# Altium schematic sheet Battery_Charger.SchDoc
size A3; SheetNumber: 3; SheetTotal: 4
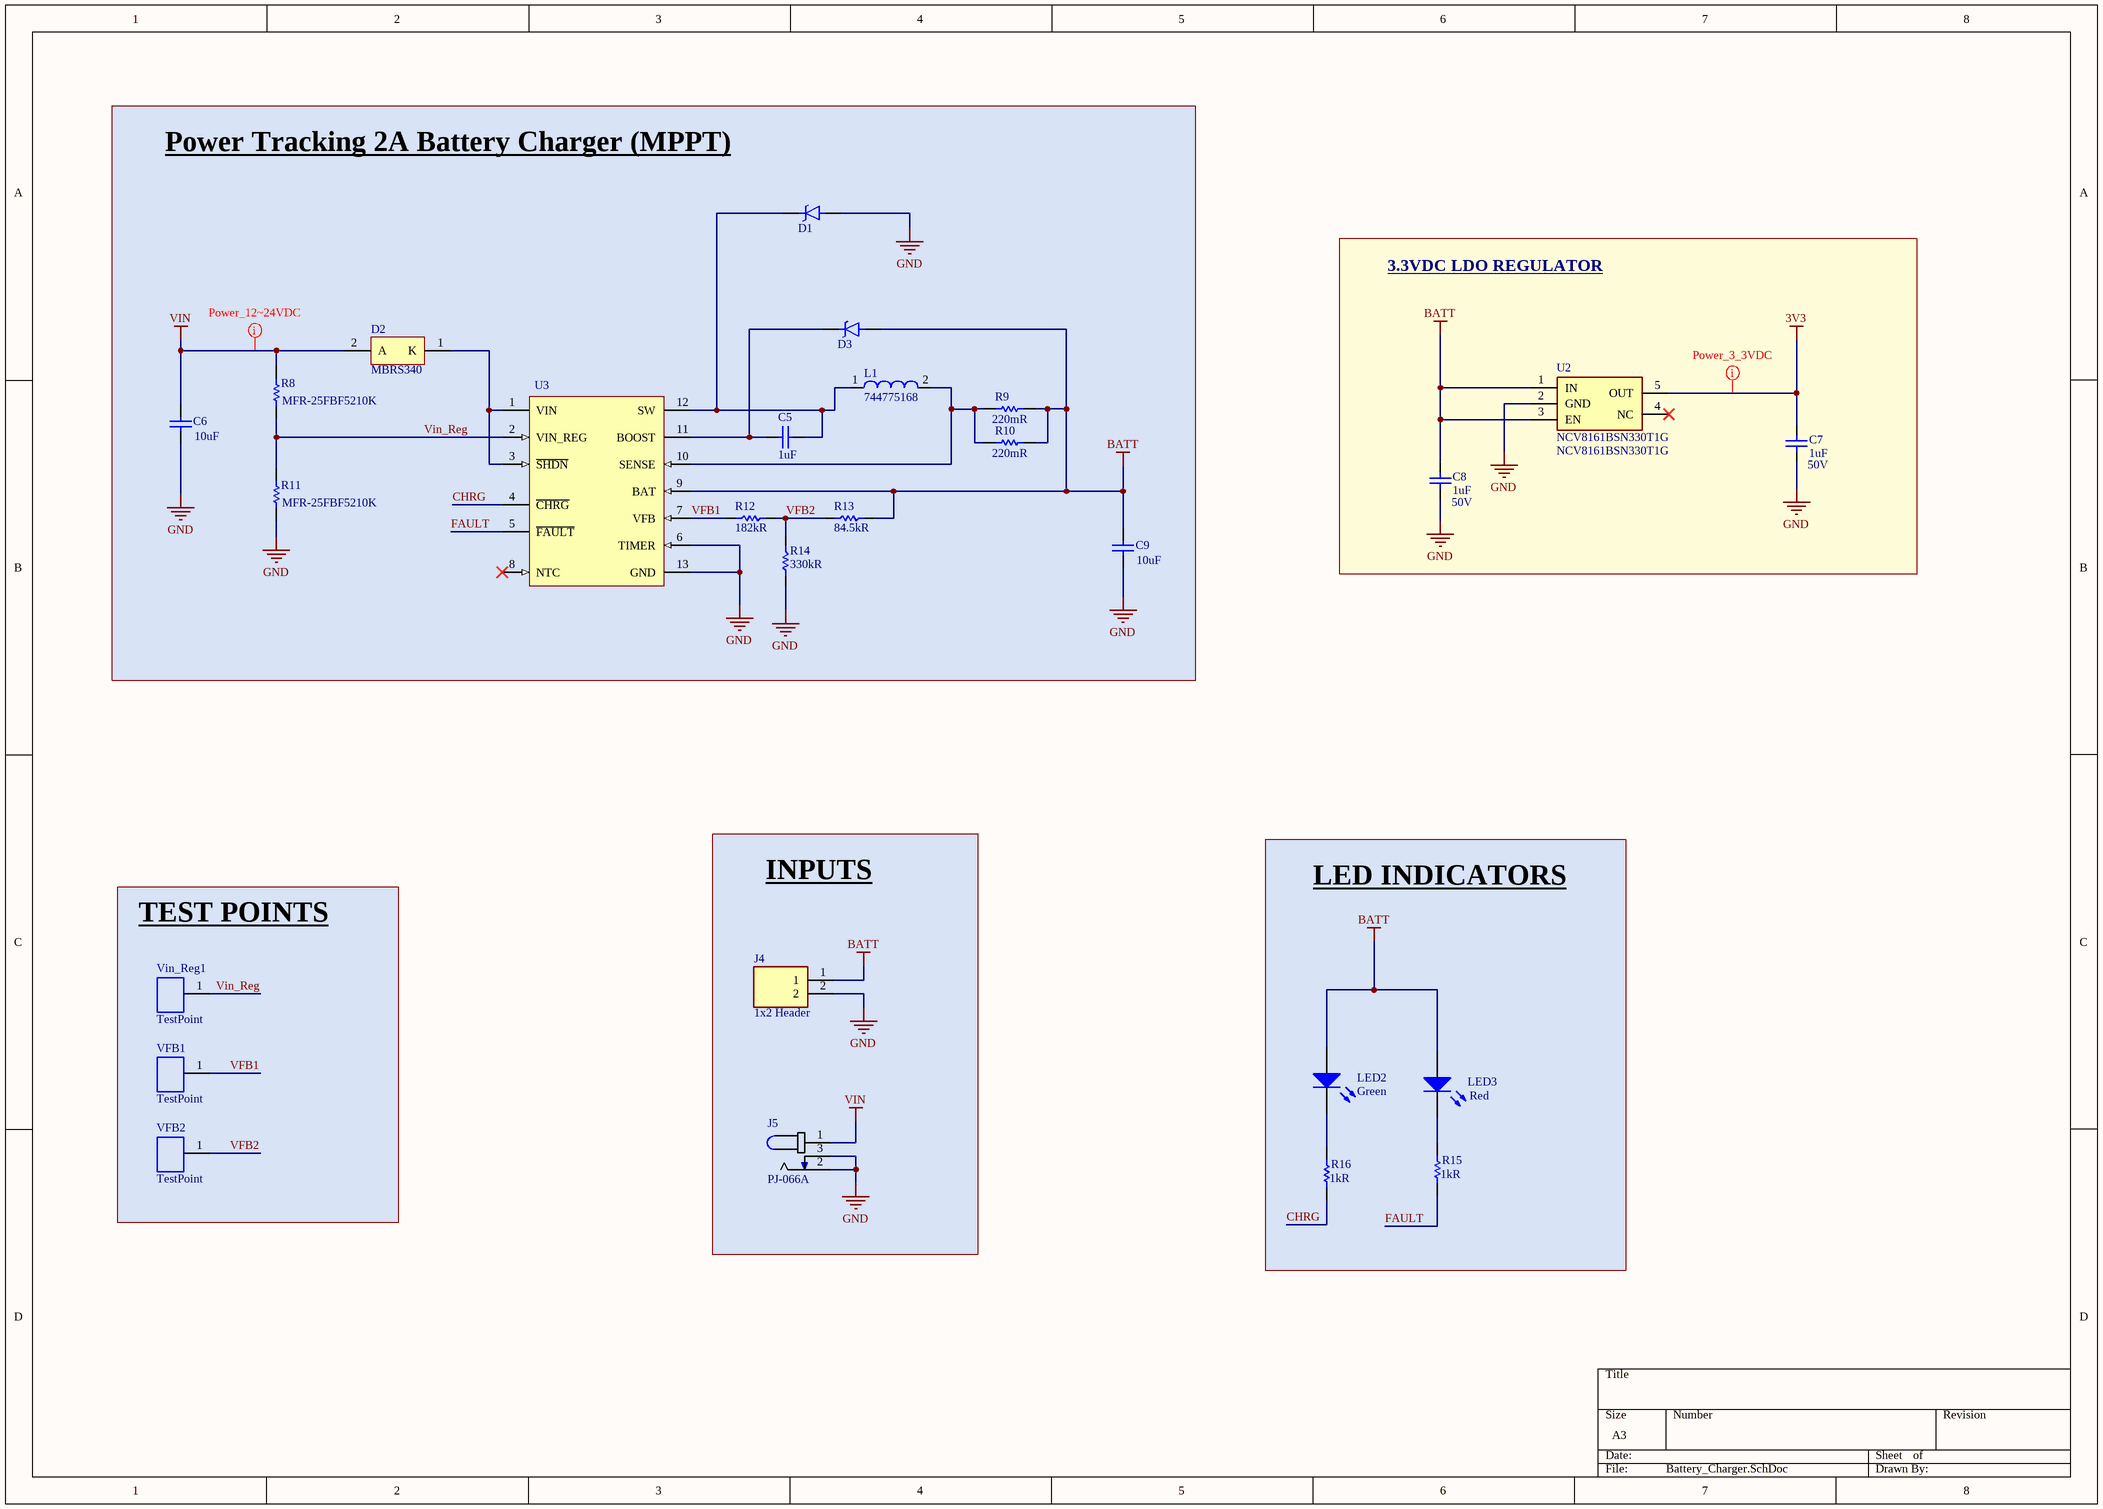
[diagram p0: Battery_Charger.SchDoc]

## Parts
C5  Capacitance: 1uF  [CAPC0805(2012)100_M]  (hidden comment: https://www.digikey.com/product-detail/en/w-rth-elektronik/885012107015/732-7625-1-ND/5454252)
C6  Capacitance: 10uF  [CAPC1206(3216)190_M]  (hidden comment: https://www.digikey.com/product-detail/en/samsung-electro-mechanics/CL31A106MBHNNNE/1276-6736-1-ND/5961595)
C7  1uF  Voltage Rating: 50V  [Cap 0805 (2012 Metric)]
C8  1uF  Voltage Rating: 50V  [Cap 0805 (2012 Metric)]
C9  Capacitance: 10uF  [CAPC1206(3216)190_M]  (hidden comment: https://www.digikey.com/product-detail/en/samsung-electro-mechanics/CL31A106MBHNNNE/1276-6736-1-ND/5961595)
D1  https://www.digikey.com/product-detail/en/diodes-incorporated/ZLLS500TA/ZLLS500CT-ND/560650  [SOT-23]  (value not drawn)
D2  Manufacturer Part Number: MBRS340  [ONSC-SMC-2-403-03_V]  (hidden comment: https://www.digikey.com/product-detail/en/on-semiconductor/MBRS340/MBRS340FSCT-ND/965655)
D3  https://www.digikey.com/product-detail/en/diodes-incorporated/ZLLS500TA/ZLLS500CT-ND/560650  [SOT-23]  (value not drawn)
J4  1x2 Header  [S2B-PH-K-S(LF)(SN)]
J5  https://www.digikey.com/product-detail/en/cui-devices/PJ-066A/CP-066A-ND/2627225  [PJ-066A]  (value not drawn)
L1  744775168  [WE-PD2-L]
LED2  Illumination Color: Green  [0805_A]  (hidden comment: https://www.digikey.com/product-detail/en/osram-opto-semiconductors-inc/LG-R971-KN-1/475-1410-1-ND/1802598)
LED3  Color: Red  [0805_A]  (hidden comment: https://www.digikey.com/product-detail/en/wurth-electronics-inc/150080RS75000/732-4984-1-ND/4489916)
R8  MFR-25FBF5210K  [RESA60-630X240]
R9  Resistance: 220mR  [RESC0805(2012)_N]  (hidden comment: https://www.digikey.com/product-detail/en/panasonic-electronic-components/ERJ-6RQFR22V/P.22DCT-ND/250302)
R10  Resistance: 220mR  [RESC0805(2012)_N]  (hidden comment: https://www.digikey.com/product-detail/en/panasonic-electronic-components/ERJ-6RQFR22V/P.22DCT-ND/250302)
R11  MFR-25FBF5210K  [RESA60-630X240]
R12  182kR  [Res 0805 (2012 Metric)]
R13  84.5kR  [Res 0805 (2012 Metric)]
R14  330kR  [Res 0805 (2012 Metric)]
R15  Resistance: 1kR  [RESC0805(2012)_M]  (hidden comment: https://www.digikey.com/product-detail/en/stackpole-electronics-inc/RNCP0805FTD1K00/RNCP0805FTD1K00CT-ND/2240568)
R16  Resistance: 1kR  [RESC0805(2012)_M]  (hidden comment: https://www.digikey.com/product-detail/en/stackpole-electronics-inc/RNCP0805FTD1K00/RNCP0805FTD1K00CT-ND/2240568)
U2  NCV8161BSN330T1G  [NCV8161BSN330T1G]
U3  https://www.digikey.com/product-detail/en/linear-technology-analog-devices/LT3652HVEMSE-TRPBF/LT3652HVEMSE-TRPBFCT-ND/8040618  [12-Lead Plastic MSOP]  (value not drawn)
VFB1  TestPoint  [TestPoint]
VFB2  TestPoint  [TestPoint]
Vin_Reg1  TestPoint  [TestPoint]

## Blocks framed on the sheet
Power Tracking 2A Battery Charger (MPPT): C5 C6 C9 D1-D3 L1 R8-R14 U3
3.3VDC LDO REGULATOR: C7 C8 U2
INPUTS: J4 J5
LED INDICATORS: LED2 LED3 R15 R16
TEST POINTS: VFB1 VFB2 Vin_Reg1

## Nets
3V3: C7.1 U2.5(OUT)
BATT: C8.1 C9.2 D3.1(A) J4.1 LED2.2(A) LED3.2(A) R9.2 R10.2 R13.2 U2.1(IN) U2.3(EN) U3.9(BAT)
GND: C6.1 C7.2 C8.2 C9.1 D1.1(A) J4.2 J5.2 J5.3 R11.2 R14.2 U2.2(GND) U3.6(TIMER) U3.13(GND)
VIN: C6.2 D2.2(A) J5.1 R8.1
CHRG: R16.2 U3.4(~{CHRG})
FAULT: R15.2 U3.5(~{FAULT})
VFB1: R12.1 U3.7(VFB) VFB1.1
VFB2: R12.2 R13.1 R14.1 VFB2.1
Vin_Reg: R8.2 R11.1 U3.2(VIN_REG) Vin_Reg1.1
NetC5_1: C5.1 D3.3(C) U3.11(BOOST)
NetC5_2: C5.2 D1.3(C) L1.1 U3.12(SW)
NetD2_1: D2.1(K) U3.1(VIN) U3.3(~{SHDN})
NetL1_2: L1.2 R9.1 R10.1 U3.10(SENSE)
NetLED2_1: LED2.1(K) R16.1
NetLED3_1: LED3.1(K) R15.1

Not connected (* = marked no-connect by the designer): U2 4(NC)*; U3 8(NTC)*

## Layout directives
net class Power_3_3VDC: 3V3
net class Power_12~24VDC: VIN

## Library data of the parts
C5 = CMP-1036-04758-1: CAP CER 1UF 25V X5R 0805; Manufacturer: Wurth Electronics; Tolerance: 20%; Supplier 1: Digi-Key; Supplier Part Number 1: 732-7625-1-ND; Manufacturer Part Number: 885012107015; Stock 1: 1863; Pricing 1: 1=0,10000, 10=0,07900, 100=0,07080, 500=0,06266 (USD); RoHS: Yes; Mount: Surface Mount; Case/Package: 0805; Case Code (Metric): 2012; Case Code (Imperial): 0805; Min Operating Temperature: -55°C; Max Operating Temperature: 85°C; Packaging: Tape and Reel; Voltage Rating: 25V; Length: 0.079inch; Width: 0.049inch; Thickness: 0.053inch; ComponentLink1URL: http://www.farnell.com/datasheets/2031769.pdf?src-supplier=Farnell; ComponentLink1Description: http://www.farnell.com/datasheets/2031769.pdf?src-supplier=Farnell; ComponentLink2URL: https://katalog.we-online.de/pbs/datasheet/885012107015.pdf?src-supplier=Digi-Key; ComponentLink2Description: https://katalog.we-online.de/pbs/datasheet/885012107015.pdf?src-supplier=Digi-Key; ComponentLink3URL: http://katalog.we-online.de/pbs/datasheet/885012107015.pdf?src-supplier=Digi-Key; ComponentLink3Description: http://katalog.we-online.de/pbs/datasheet/885012107015.pdf?src-supplier=Digi-Key; Link: https://www.digikey.com/es/products/detail/w%C3%BCrth-elektronik/885012107015/5453480?s=N4IgTCBcDaIBxwKwAYCMZXIOxsSAugL5A
C6 C9 = CMP-1037-04982-1: CAP CER 10UF 50V X5R 1206; Tolerance: 20%; Supplier 1: Digi-Key; Supplier Part Number 1: 1276-6736-1-ND; Manufacturer: Samsung; Manufacturer Part Number: CL31A106MBHNNNE; Stock 1: 630197; Pricing 1: 1=0,30000, 10=0,20800, 100=0,11800, 500=0,08328, 1000=0,07287 (USD); RoHS: Yes; Mount: Surface Mount; Case/Package: 1206; Case Code (Metric): 3216; Case Code (Imperial): 1206; Min Operating Temperature: -55°C; Max Operating Temperature: 85°C; Packaging: Tape and Reel; Voltage Rating: 50V; Dielectric: X5R; Voltage Rating (DC): 50V; Length: 0.126inch; Width: 0.063inch; Thickness: 0.071inch; ComponentLink1URL: http://www.samsungsem.com/kr/support/product-search/mlcc/CL31A106MBHNNNE.jsp?src-supplier=Digi-Key; ComponentLink1Description: http://www.samsungsem.com/kr/support/product-search/mlcc/CL31A106MBHNNNE.jsp?src-supplier=Digi-Key
  C6: Link: https://www.digikey.com/en/products/detail/samsung-electro-mechanics/CL31A106MBHNNNE/5961220?s=N4IgTCBcDaIMIBkDMBGAgigDANgLICEAJAOVIFEQBdAXyA
  C9: ComponentLink2Description: New link; ComponentLink2URL: *; Link: https://www.digikey.com/es/products/detail/samsung-electro-mechanics/CL31A106MBHNNNE/5961220?s=N4IgTCBcDaIMIBkDMBGAgigDANgLICEAJAOVIFEQBdAXyA
C7 C8 = Capacitor: Cap Ceramic 1uF 50V Y5V -20% to 80% SMD 0805 85C T/R; Manufacturer: Samsung; Manufacturer Part Number: CL21F105ZBFNNNG; Link: https://www.digikey.com/en/products/detail/samsung-electro-mechanics/CL21F105ZBFNNNG/3894627; Supplier 1: Digi-Key; Supplier Part Number 1: 1276-6495-1-ND; RoHS: Yes; Category: Ceramic Capacitors; Stock 1: 53286; Pricing 1: 1=0,14000, 10=0,10300, 50=0,05840, 100=0,04840, 500=0,03396, 1000=0,02811 (USD); Mount: Surface Mount; Case/Package: 0805; Case Code (Metric): 2012; Case Code (Imperial): 0805; Material: Ceramic; Min Operating Temperature: -30°C; Max Operating Temperature: 85°C; Tolerance: 80%; Packaging: Tape and Reel; Capacitance: 1uF; Package Quantity: 3000; Dielectric: Y5V; Length: 2mm; Width: 0.049inch; Thickness: 0.053inch; Depth: 1.25mm; Radiation Hardening: No; Lead Free: Lead Free; RoHS Compliant: Yes; ComponentLink1URL: https://datasheet.ciiva.com/25734/cl21f105zbfnnng-25734639.pdf?src-supplier=Digi-Key; ComponentLink1Description: https://datasheet.ciiva.com/25734/cl21f105zbfnnng-25734639.pdf?src-supplier=Digi-Key; ComponentLink2URL: https://datasheet.ciiva.com/26838/getdatasheetpartid-650871-26838829.pdf?src-supplier=Verical; ComponentLink2Description: https://datasheet.ciiva.com/26838/getdatasheetpartid-650871-26838829.pdf?src-supplier=Verical; ComponentLink3URL: https://datasheet.ciiva.com/29199/455947-da-01-en-vs-kondensator-0805-29199048.pdf?src-supplier=Conrad; ComponentLink3Description: https://datasheet.ciiva.com/29199/455947-da-01-en-vs-kondensator-0805-29199048.pdf?src-supplier=Conrad; ComponentLink4URL: https://datasheet.ciiva.com/26310/mlcc-catalogdownload2013-eng-26310157.pdf?src-supplier=Distrelec; ComponentLink4Description: https://datasheet.ciiva.com/26310/mlcc-catalogdownload2013-eng-26310157.pdf?src-supplier=Distrelec; ComponentLink5URL: https://datasheet.ciiva.com/16437/cl05b104kq5nnnc-16437223.pdf?src-supplier=Future+Electronics; ComponentLink5Description: https://datasheet.ciiva.com/16437/cl05b104kq5nnnc-16437223.pdf?src-supplier=Future+Electronics
D1 D3 = ZLLS500TA: DIODE SCHOTTKY 40V 700MA SOT23-3; Manufacturer: Diodes Zetex; Peak Non-Repetitive Surge Current: 13A; Element Configuration: Single; Forward Voltage: 800mV; Peak Reverse Current: 10uA; Reverse Recovery Time: 3ns; Max Forward Surge Current (Ifsm): 3.2A; Power Dissipation: 500mW; Polarity: Standard; Capacitance: 16pF; Supplier 1: Digi-Key; Stock 1: 48400; Pricing 1: 1=0,50000, 10=0,42900, 100=0,32030, 500=0,25168, 1000=0,19448 (USD); RoHS: Yes; Mount: Surface Mount; Case/Package: SOT-23; Number of Pins: 3; Weight: 0.000282oz; Min Operating Temperature: -55°C; Max Operating Temperature: 150°C; Forward Current: 700mA; Max Repetitive Reverse Voltage (Vrrm): 40V; Package Quantity: 3000; Packaging: Tape and Reel; Average Rectified Current: 700mA; Termination: SMD/SMT; Voltage Rating (DC): 40V; Current Rating: 700mA; Output Current: 700mA; Max Reverse Voltage (DC): 40V; Length: 3.05mm; Height: 1mm; Width: 1.4mm; Radiation Hardening: No; Lead Free: Lead Free; ComponentLink1URL: https://datasheet.ciiva.com/914/zlls500-914480.pdf?src-supplier=Digi-Key; ComponentLink1Description: https://datasheet.ciiva.com/914/zlls500-914480.pdf?src-supplier=Digi-Key; ComponentLink2URL: https://datasheet.ciiva.com/4715/zlls500-4715543.pdf?src-supplier=Mouser; ComponentLink2Description: https://datasheet.ciiva.com/4715/zlls500-4715543.pdf?src-supplier=Mouser; ComponentLink3URL: https://datasheet.ciiva.com/8301/zlls500-8301566.pdf?src-supplier=Avnet; ComponentLink3Description: https://datasheet.ciiva.com/8301/zlls500-8301566.pdf?src-supplier=Avnet; Supplier Part Number 1: ZLLS500CT-ND; Manufacturer Part Number: ZLLS500TA; Link: https://www.digikey.com/es/products/detail/diodes-incorporated/ZLLS500TA/560622
D2 = CMP-1055-00395-1: DIODE SCHOTTKY 40V 4A SMC; Manufacturer: ON Semiconductor / Fairchild; Element Configuration: Single; Forward Voltage: 525mV; Max Surge Current: 80A; Current Rating: 3A; Peak Reverse Current: 2mA; Polarity: Standard; ComponentLink2URL: http://www.onsemi.cn/pub_link/Collateral/MBRS340T3-D.PDF; ComponentLink2Description: Datasheet; ComponentLink1URL: http://www.onsemi.com/; ComponentLink1Description: Manufacturer URL; ComponentLink3Description: Package Specification; ComponentLink3URL: http://www.onsemi.com/pub_link/Collateral/403-03.PDF; Supplier 1: Digi-Key; Supplier Part Number 1: MBRS340FSCT-ND; Stock 1: 6086; Pricing 1: 1=0,47000, 10=0,37700, 100=0,25680, 500=0,19258, 1000=0,14443 (USD); RoHS: Yes; Mount: Surface Mount; Case/Package: SMC; Number of Pins: 2; Weight: 0.3g; Contact Plating: Tin,Matte; Min Operating Temperature: -65°C; Max Operating Temperature: 125°C; Packaging: Tape and Reel; Average Rectified Current: 4A; Max Reverse Voltage (DC): 40V; Package Quantity: 1; Max Repetitive Reverse Voltage (Vrrm): 40V; Forward Current: 4A; Max Reverse Leakage Current: 2mA; Peak Non-Repetitive Surge Current: 80A; Max Forward Surge Current (Ifsm): 80A; Voltage Rating (DC): 40V; Output Current: 3A; Length: 7.15mm; Height: 2.75mm; Width: 6.25mm; Radiation Hardening: No; Lead Free: Lead Free; REACH SVHC: No SVHC; ComponentLink4URL: https://datasheet.ciiva.com/22651/48013-22651968.pdf?src-supplier=Element14; ComponentLink4Description: https://datasheet.ciiva.com/22651/48013-22651968.pdf?src-supplier=Element14; ComponentLink5URL: https://datasheet.ciiva.com/4714/mbrs340-63506-4714275.pdf?src-supplier=Mouser; ComponentLink5Description: https://datasheet.ciiva.com/4714/mbrs340-63506-4714275.pdf?src-supplier=Mouser; ComponentLink6URL: https://datasheet.ciiva.com/30479/0900766b810e2514-30479354.pdf?src-supplier=RSComponents; ComponentLink6Description: https://datasheet.ciiva.com/30479/0900766b810e2514-30479354.pdf?src-supplier=RSComponents; ComponentLink7URL: https://datasheet.ciiva.com/26788/mbrs340-26788710.pdf?src-supplier=IIIC; ComponentLink7Description: https://datasheet.ciiva.com/26788/mbrs340-26788710.pdf?src-supplier=IIIC; ComponentLink8URL: https://datasheet.ciiva.com/8303/mbrs340-8303605.pdf?src-supplier=Avnet; ComponentLink8Description: https://datasheet.ciiva.com/8303/mbrs340-8303605.pdf?src-supplier=Avnet; ComponentLink9URL: https://datasheet.ciiva.com/8303/mbrs340-8303610.pdf?src-supplier=Avnet; ComponentLink9Description: https://datasheet.ciiva.com/8303/mbrs340-8303610.pdf?src-supplier=Avnet; ComponentLink10URL: https://datasheet.ciiva.com/911/mbrs340-911131.pdf?src-supplier=Digi-Key; ComponentLink10Description: https://datasheet.ciiva.com/911/mbrs340-911131.pdf?src-supplier=Digi-Key; ComponentLink11URL: https://datasheet.ciiva.com/911/mbrs340-911132.pdf?src-supplier=Digi-Key; ComponentLink11Description: https://datasheet.ciiva.com/911/mbrs340-911132.pdf?src-supplier=Digi-Key; ComponentLink12URL: https://datasheet.ciiva.com/911/mbrs340-911133.pdf?src-supplier=Digi-Key; ComponentLink12Description: https://datasheet.ciiva.com/911/mbrs340-911133.pdf?src-supplier=Digi-Key; ComponentLink13URL: https://datasheet.ciiva.com/15144/getdatasheetpartid-102412-15144829.pdf?src-supplier=Verical; ComponentLink13Description: https://datasheet.ciiva.com/15144/getdatasheetpartid-102412-15144829.pdf?src-supplier=Verical; ComponentLink14URL: https://datasheet.ciiva.com/25951/mbrs340-25951711.pdf?src-supplier=Avnet+Europe; ComponentLink14Description: https://datasheet.ciiva.com/25951/mbrs340-25951711.pdf?src-supplier=Avnet+Europe; ComponentLink15Description: New link; ComponentLink15URL: *; Link: https://www.digikey.com/en/products/detail/fairchild-semiconductor/MBRS340/13518721
J4 = S2B-PH-K-S(LF)(SN): Conn Shrouded Header (4 Sides) HDR 2 POS 2mm Solder RA Thru-Hole Box; Manufacturer: JST; Current Rating: 2A; Gender: Male; Contact Resistance: 20mR; Voltage Rating: 100V; Connector Type: Male Pin; Number of Positions: 2; Insulation Resistance: 1GR; Supplier 1: Farnell; Manufacturer Part Number: S2B-PH-K-S(LF)(SN); RoHS: Yes; Category: Headers and Wire Housings; Stock 1: 138746; Pricing 1: 100=0,06350, 1000=0,05550, 2500=0,05160, 5000=0,04760, 10000=0,04630, 20000=0,04540 (GBP); Mount: Through Hole; Number of Pins: 2; Contact Material: Tin,Brass,Bronze; Contact Plating: Tin,Copper; Color: Natural,White; Housing Color: White; Housing Material: Polyamide; Min Operating Temperature: -25°C; Max Operating Temperature: 85°C; Max Current Rating: 2A; Number of Rows: 1; Orientation: Right Angle; Packaging: Bulk; Termination: Solder; Fastening Type: Detent; Number of Contacts: 2; Max Voltage Rating (AC): 100V; Number of Poles: 2; Voltage Rating (AC): 100V; Max Voltage Rating (DC): 100V; Working Voltage: 100V; Length: 5.9mm; Height: 9.4mm; Pitch: 2mm; Width: 4.5mm; Contact Mating Length: 0.13inch; Depth: 7.6mm; Lead Pitch: 2mm; REACH SVHC: No SVHC; Lead Free: Lead Free; Flammability Rating: UL94 V-0; ComponentLink1URL: https://datasheet.ciiva.com/11747/0900766b8082f558-11747128.pdf?src-supplier=RSComponents; ComponentLink1Description: https://datasheet.ciiva.com/11747/0900766b8082f558-11747128.pdf?src-supplier=RSComponents; ComponentLink2URL: https://datasheet.ciiva.com/16484/s2b-ph-k-slfsn-16484405.pdf?src-supplier=Future+Electronics; ComponentLink2Description: https://datasheet.ciiva.com/16484/s2b-ph-k-slfsn-16484405.pdf?src-supplier=Future+Electronics; ComponentLink3URL: https://datasheet.ciiva.com/26894/getdatasheetpartid-641020-26894599.pdf?src-supplier=Verical; ComponentLink3Description: https://datasheet.ciiva.com/26894/getdatasheetpartid-641020-26894599.pdf?src-supplier=Verical; ComponentLink4URL: https://datasheet.ciiva.com/712/eph-712447.pdf?src-supplier=Digi-Key; ComponentLink4Description: https://datasheet.ciiva.com/712/eph-712447.pdf?src-supplier=Digi-Key; ComponentLink5URL: https://datasheet.ciiva.com/8052/80564-8052207.pdf?src-supplier=Element14; ComponentLink5Description: https://datasheet.ciiva.com/8052/80564-8052207.pdf?src-supplier=Element14; Link: https://www.digikey.com/products/en?keywords=S2B-PH-K-S(LF)(SN); Supplier Part Number 1: 9491902
J5 = PJ-066A: CONN PWR JACK 2X5.5MM SOLDER; Manufacturer: CUI; Gender: Male; Shielding: Unshielded; Current Rating: 5A; Voltage Rating: 24V; Insulation Resistance: 100MR; Number of Conductors: 2; Supplier 1: Digi-Key; Stock 1: 24215; Pricing 1: 1=2,27000, 10=2,06300, 25=1,93680, 50=1,85240, 100=1,76820, 250=1,59980, 500=1,47350, 1000=1,26300, 2500=1,17880 (USD); RoHS: Yes; Mount: Through Hole,Panel,Bulkhead; Color: Black; Contact Material: Brass; Contact Plating: Nickel,Silver; Housing Color: Black; Housing Material: Thermoplastic; Min Operating Temperature: -25°C; Max Operating Temperature: 70°C; Package Quantity: 500; Termination: Solder; Connector Type: Jack; Contact Gender: Male; Packaging: Bulk; Orientation: Horizontal; Lead Free: Lead Free; ComponentLink1URL: http://www.mouser.com/ds/2/670/3176-528077.pdf?src-supplier=Mouser; ComponentLink1Description: http://www.mouser.com/ds/2/670/3176-528077.pdf?src-supplier=Mouser; ComponentLink2URL: http://www.cui.com/product/resource/digikeypdf/pj-066a.pdf?src-supplier=Digi-Key; ComponentLink2Description: http://www.cui.com/product/resource/digikeypdf/pj-066a.pdf?src-supplier=Digi-Key; Supplier Part Number 1: CP-066A-ND; Manufacturer Part Number: PJ-066A; Link: https://www.digikey.com/es/products/detail/cui-devices/PJ-066A/2627225?s=N4IgTCBcDaIAoCkC0AGAbGggiAugXyA
L1 = CMP-0227-00473-1: SMD Power Inductor WE-PD2, L = 68.0 µH; Manufacturer: Wurth Electronics; Inductance: 68.0 ÂµH; Description: WE-PD2; Unshielded Wire-wound SMD Inductor with Ferrite Core; 68 µH; 990mA I; Core Material: Ferrite; Inductance Tolerance: 10%; Self Resonant Frequency: 8MHz; Current Rating: 990mA; Saturation Current: 1.05A; Shielding: Unshielded; Resistance: 280mR; Test Frequency: 1kHz; ComponentLink2URL: http://www.we-online.de/katalog/media/pdf/744775168.pdf; PackageReference: WE-PD2-L; ComponentLink2Description: Datasheet; ComponentLink1URL: http://www.we-online.com; PackageVersion: 2004; PackageDescription: SMD Inductor, 2-Leads, Body 7.8 x 7.0 mm; DatasheetVersion: ver 1, Oct-2004; ComponentLink1Description: Manufacturer Link; Supplier 1: RSComponents; Supplier Part Number 1: 5227064; Manufacturer Part Number: 744775168; RoHS: Yes; Category: Fixed Inductors; Stock 1: 1; Pricing 1: 1=2,21900, 10=1,93700, 100=1,72100, 500=1,52000, 1000=1,43900 (USD); Mount: Surface Mount; Case/Package: 8012; Number of Pins: 2; Min Operating Temperature: -40°C; Max Operating Temperature: 125°C; Packaging: Cut Tape; Tolerance: 10%; Package Quantity: 500; DC Resistance (DCR): 280mR; Max DC Current: 990mA; Termination: SMD/SMT; RMS Current (Irms): 990mA; Series: WE-PD2; Length: 7.8mm; Width: 0.276inch; Height: 5mm; Depth: 7mm; REACH SVHC: Unknown; RoHS Compliant: Yes; ComponentLink3URL: https://datasheet.ciiva.com/7892/1736435-7892907.pdf?src-supplier=Element14; ComponentLink3Description: https://datasheet.ciiva.com/7892/1736435-7892907.pdf?src-supplier=Element14; ComponentLink4URL: https://datasheet.ciiva.com/11799/0900766b80648d05-11799554.pdf?src-supplier=RSComponents; ComponentLink4Description: https://datasheet.ciiva.com/11799/0900766b80648d05-11799554.pdf?src-supplier=RSComponents; ComponentLink5URL: https://datasheet.ciiva.com/4954/744775168-12256-4954678.pdf?src-supplier=Mouser; ComponentLink5Description: https://datasheet.ciiva.com/4954/744775168-12256-4954678.pdf?src-supplier=Mouser; ComponentLink6URL: https://datasheet.ciiva.com/6710/744775168-6710771.pdf?src-supplier=Digi-Key; ComponentLink6Description: https://datasheet.ciiva.com/6710/744775168-6710771.pdf?src-supplier=Digi-Key; ComponentLink7URL: https://datasheet.ciiva.com/6710/744775168-6710773.pdf?src-supplier=Digi-Key; ComponentLink7Description: https://datasheet.ciiva.com/6710/744775168-6710773.pdf?src-supplier=Digi-Key; ComponentLink8URL: https://datasheet.ciiva.com/48690/001087893-da-01-ml-we-pd2-smd-speicherdrossel-l-744-de-en-48690581.pdf?src-supplier=Conrad; ComponentLink8Description: https://datasheet.ciiva.com/48690/001087893-da-01-ml-we-pd2-smd-speicherdrossel-l-744-de-en-48690581.pdf?src-supplier=Conrad; Link: https://www.digikey.com/es/products/detail/744775168/732-1291-1-ND/1639352?utm_campaign=buynow&utm_medium=aggregator&curr=usd&utm_source=octopart
LED2 = CMP-1426-00007-1: LED GREEN DIFFUSED 0805 SMD; PartNumber: 150080GS75000; Manufacturer: Wuerth Elektronik; Manufacturer Part Number: LGR971-KN-1; Lens Color: White; Forward Current: 25mA; Forward Voltage: 2.2V; Luminous Intensity: 45mcd; Viewing Angle: 160°; Test Current: 20mA; Dominant Wavelength: 570nm; Luminous Flux: 0.1lm; Number of Elements: 1; Power Dissipation: 65mW; Reverse Voltage: 12V; PackageReference: 0805_A; Color: Green; ComponentLink2URL: http://katalog.we-online.com/led/datasheet/150080GS75000.pdf; ComponentLink1URL: http://www.we-online.com; ComponentLink1Description: Manufacturer URL; ComponentLink2Description: Datasheet; Supplier 1: Digi-Key; Supplier Part Number 1: 475-1410-2-ND; Stock 1: 132000; Pricing 1: 4000 = 0,052720, 8000 = 0,045840, 12000 = 0,041260, 28000 = 0,036670, 100000 = 0,030940 (USD); RoHS: Yes; Mount: Surface Mount; Case/Package: 0805; Number of Pins: 2; Case Code (Metric): 2012; Case Code (Imperial): 0805; Min Operating Temperature: -30°C; Max Operating Temperature: 85°C; Packaging: Tape and Reel; Lens Style: Diffused; Package Quantity: 1; Lens Transparency: Diffused; Number of LEDs: 1; Length: 2.1mm; Height: 0.9mm; Width: 1.25mm; Depth: 1.35mm; Radiation Hardening: No; ComponentLink3URL: https://datasheet.ciiva.com/15198/getdatasheetpartid-233880-15198360.pdf?src-supplier=Verical; ComponentLink3Description: https://datasheet.ciiva.com/15198/getdatasheetpartid-233880-15198360.pdf?src-supplier=Verical; ComponentLink4URL: https://datasheet.ciiva.com/15198/getdatasheetpartid-462214-15198395.pdf?src-supplier=Verical; ComponentLink4Description: https://datasheet.ciiva.com/15198/getdatasheetpartid-462214-15198395.pdf?src-supplier=Verical; ComponentLink5URL: https://datasheet.ciiva.com/4688/g-r971-221296-4688589.pdf?src-supplier=Mouser; ComponentLink5Description: https://datasheet.ciiva.com/4688/g-r971-221296-4688589.pdf?src-supplier=Mouser; ComponentLink6URL: https://datasheet.ciiva.com/14918/00078860-0-14918604.pdf?src-supplier=Digi-Key; ComponentLink6Description: https://datasheet.ciiva.com/14918/00078860-0-14918604.pdf?src-supplier=Digi-Key; ComponentLink7URL: https://datasheet.ciiva.com/14918/00078860-0-14918605.pdf?src-supplier=Digi-Key; ComponentLink7Description: https://datasheet.ciiva.com/14918/00078860-0-14918605.pdf?src-supplier=Digi-Key; ComponentLink8URL: https://datasheet.ciiva.com/14918/00078860-0-14918606.pdf?src-supplier=Digi-Key; ComponentLink8Description: https://datasheet.ciiva.com/14918/00078860-0-14918606.pdf?src-supplier=Digi-Key; Link: https://www.digikey.com/es/products/detail/osram-opto-semiconductors-inc/LG-R971-KN-1/1227925?s=N4IgTCBcDaIDIHEBKBOA7ARgLQGkByWGIAugL5A
LED3 = CMP-1426-00007-1: LED RED CLEAR 0805 SMD; Manufacturer: Wurth Electronics; Luminous Intensity: 150mcd; Viewing Angle: 140°; Forward Voltage: 2V; Wavelength: 625nm; Forward Current: 30mA; Test Current: 20mA; ComponentLink2URL: http://katalog.we-online.com/led/datasheet/150080GS75000.pdf; ComponentLink1URL: http://www.we-online.com; ComponentLink1Description: Manufacturer URL; ComponentLink2Description: Datasheet; ComponentLink3URL: https://datasheet.ciiva.com/15198/getdatasheetpartid-233880-15198360.pdf?src-supplier=Verical; ComponentLink3Description: https://datasheet.ciiva.com/15198/getdatasheetpartid-233880-15198360.pdf?src-supplier=Verical; ComponentLink4URL: https://datasheet.ciiva.com/15198/getdatasheetpartid-462214-15198395.pdf?src-supplier=Verical; ComponentLink4Description: https://datasheet.ciiva.com/15198/getdatasheetpartid-462214-15198395.pdf?src-supplier=Verical; ComponentLink5URL: https://datasheet.ciiva.com/4688/g-r971-221296-4688589.pdf?src-supplier=Mouser; ComponentLink5Description: https://datasheet.ciiva.com/4688/g-r971-221296-4688589.pdf?src-supplier=Mouser; ComponentLink6URL: https://datasheet.ciiva.com/14918/00078860-0-14918604.pdf?src-supplier=Digi-Key; ComponentLink6Description: https://datasheet.ciiva.com/14918/00078860-0-14918604.pdf?src-supplier=Digi-Key; ComponentLink7URL: https://datasheet.ciiva.com/14918/00078860-0-14918605.pdf?src-supplier=Digi-Key; ComponentLink7Description: https://datasheet.ciiva.com/14918/00078860-0-14918605.pdf?src-supplier=Digi-Key; ComponentLink8URL: https://datasheet.ciiva.com/14918/00078860-0-14918606.pdf?src-supplier=Digi-Key; ComponentLink8Description: https://datasheet.ciiva.com/14918/00078860-0-14918606.pdf?src-supplier=Digi-Key; Supplier 1: Digi-Key; Supplier Part Number 1: 732-4984-1-ND; Manufacturer Part Number: 150080RS75000; Stock 1: 18634; Pricing 1: 1 = 0,17000, 50 = 0,16000, 100 = 0,13700, 500 = 0,11800 (USD); RoHS: Yes; Mount: Surface Mount; Case/Package: 0805; Case Code (Metric): 2012; Case Code (Imperial): 0805; Min Operating Temperature: -40°C; Max Operating Temperature: 85°C; Package Quantity: 4000; Lens Style: Clear; Packaging: Tape and Reel; Dominant Wavelength: 625nm; Length: 2mm; Height: 0.7mm; Width: 1.25mm; REACH SVHC: Unknown; ComponentLink9URL: https://datasheet.ciiva.com/22656/150080rs75000-22656961.pdf?src-supplier=Element14; ComponentLink9Description: https://datasheet.ciiva.com/22656/150080rs75000-22656961.pdf?src-supplier=Element14; ComponentLink10URL: https://datasheet.ciiva.com/29279/759435-da-01-en-chipled-0805-w-kl-rot-150080rs75000-29279032.pdf?src-supplier=Conrad; ComponentLink10Description: https://datasheet.ciiva.com/29279/759435-da-01-en-chipled-0805-w-kl-rot-150080rs75000-29279032.pdf?src-supplier=Conrad; ComponentLink11Description: New link; ComponentLink11URL: *; Link: https://www.digikey.com/es/products/detail/w%C3%BCrth-elektronik/150080RS75000/4489918?s=N4IgTCBcDaIIwFYAMSAcSBKBlA7MlIAugL5A
R8 R11 = CMP-2000-07564-1: Axial Resistor, 10 KOhm, +/- 1%, 0.25 W, -55 to 155 degC, 2-Pin THD, RoHS, Bulk; Manufacturer: Yageo; Temperature Coefficient: 100ppm\/degreesC; Voltage Rating: 250V; Voltage Rating (DC): 200V; Resistance: 10KOhm; Max Power Dissipation: 250mW; Datasheet URL: http://www.yageo.com/documents/recent/Yageo%20LR_MFR_2013.pdf; Packaging: Bulk; RoHSCompliant: True; Mount: ThroughHole; Package Reference: MFR-25; Termination: Axial; Composition: MetalFilm; Number of Terminations: 2; Package Quantity: 200; Mounting Technology: ThroughHole; Length: 0.248inch; Max Operating Temperature: 155degC; Min Operating Temperature: -55degC; Datasheet Version: 04/2013; Lead Free: LeadFree; Manufacturer URL: http://www.yageo.com/; Tolerance: 1%; Power Rating: 250mW; Package Description: 2-Pin Axial Lead, Dia 2.4 mm, Body Length 6.3 mm; Military Standard: Not; Case\/Package: Axial; Manufacturer Part Number: MFR-25FBF5210K; Link: https://www.digikey.com/en/products/detail/yageo/MFR-25FBF52-10K5/13223
R9 R10 = CMP-1013-00171-1: RES 0.22 OHM 1% 1/8W 0805; Temperature Coefficient: 250ppm/°C; Power Rating: 125mW; Supplier 1: Digi-Key; Supplier Part Number 1: P.22DDKR-ND; Manufacturer: Panasonic; Manufacturer Part Number: ERJ-6RQFR22V; Stock 1: 30700; Pricing 1: 1=0.37, 10=0.311, 25=0.2264, 50=0.1642, 100=0.1217, 250=0.0934, 500=0.07358, 1000=0.05094 (USD); Mount: Surface Mount; Case/Package: 0805; Number of Pins: 2; Contact Plating: Tin; Case Code (Imperial): 0805; Case Code (Metric): 2012; Min Operating Temperature: -55°C; Max Operating Temperature: 125°C; Tolerance: 1%; Composition: Thick Film; Packaging: Tape and Reel; Package Quantity: 5000; Termination: SMD/SMT; Number of Terminations: 2; Military Standard: Not; Max Power Dissipation: 125mW; Length: 2mm; Height: 0.6mm; Width: 1.2mm; Depth: 1.25mm; Radiation Hardening: No; REACH SVHC: No SVHC; Lead Free: Lead Free; ComponentLink1URL: http://uk.rs-online.com/webdocs/13b8/0900766b813b869e.pdf?src-supplier=RSComponents; ComponentLink1Description: http://uk.rs-online.com/webdocs/13b8/0900766b813b869e.pdf?src-supplier=RSComponents; ComponentLink2URL: http://industrial.panasonic.com/www-data/pdf/AOA0000/AOA0000CE3.pdf?src-supplier=Avnet+Europe; ComponentLink2Description: http://industrial.panasonic.com/www-data/pdf/AOA0000/AOA0000CE3.pdf?src-supplier=Avnet+Europe; ComponentLink3URL: http://www.mouser.com/ds/2/315/AOA0000C295-1109214.pdf?src-supplier=Mouser; ComponentLink3Description: http://www.mouser.com/ds/2/315/AOA0000C295-1109214.pdf?src-supplier=Mouser; ComponentLink4URL: https://www.alliedelec.com/m/d/343577d27580f3e2a275b8e77c10f6b8.pdf?src-supplier=Allied+Electronics; ComponentLink4Description: https://www.alliedelec.com/m/d/343577d27580f3e2a275b8e77c10f6b8.pdf?src-supplier=Allied+Electronics; ComponentLink5URL: http://www.farnell.com/datasheets/2197344.pdf?src-supplier=Farnell; ComponentLink5Description: http://www.farnell.com/datasheets/2197344.pdf?src-supplier=Farnell; ComponentLink6URL: http://www.farnell.com/datasheets/391509.pdf?src-supplier=Element14; ComponentLink6Description: http://www.farnell.com/datasheets/391509.pdf?src-supplier=Element14; ComponentLink7URL: http://industrial.panasonic.com/cdbs/www-data/pdf/RDN0000/AOA0000C313.pdf?src-supplier=Farnell; ComponentLink7Description: http://industrial.panasonic.com/cdbs/www-data/pdf/RDN0000/AOA0000C313.pdf?src-supplier=Farnell; Link: https://www.digikey.com/es/products/detail/panasonic-electronic-components/ERJ-6RQFR22V/250185?s=N4IgTCBcDaIKICUBSBaAbAgigMQWMAaiALoC%2BQA
R12 = Resistor: Res Thick Film 0805 182K Ohm 1% 1/8W ±100ppm/°C Molded SMD Punched Carrier T/R; Manufacturer: Panasonic; Manufacturer Part Number: ERJ-6ENF1823V; Max Power Dissipation: 125mW; Voltage Rating: 150V; Link: https://www.digikey.com/es/products/detail/ERJ-6ENF1823V/P182KCDKR-ND/576537?utm_campaign=buynow&utm_medium=aggregator&curr=usd&utm_source=octopart; Supplier 1: Digi-Key; Supplier Part Number 1: P182KCDKR-ND; RoHS: Yes; Category: Chip SMD Resistors; Stock 1: 47548; Pricing 1: 1=0,10000, 10=0,08900, 100=0,03440, 1000=0,01512, 2500=0,01306 (USD); Mount: Surface Mount; Case/Package: 0805; Case Code (Metric): 2012; Case Code (Imperial): 0805; Contact Plating: Tin; Weight: 0.000194oz; Min Operating Temperature: -55°C; Max Operating Temperature: 155°C; Resistance: 182kR; Tolerance: 1%; Packaging: Tape and Reel; Package Quantity: 1; Resistor Type: Thick Film; Number of Terminations: 2; Temperature Coefficient: 100ppm/°C; Series: ERJ; Power Rating: 125mW; Features: Automotive AEC-Q200; Termination: SMD/SMT; Voltage Rating (DC): 150V; Technology: THICK FILM; Construction: Rectangular; Resistance Tolerance: 1%; Length: 2mm; Width: 0.049inch; Height: 0.6mm; Depth: 1.25mm; RoHS Compliant: Yes; Lead Free: Lead Free; Military Standard: Not; REACH SVHC: Yes; ComponentLink1URL: https://datasheet.ciiva.com/9184/aoa0000ce2-9184863.pdf?src-supplier=Avnet; ComponentLink1Description: https://datasheet.ciiva.com/9184/aoa0000ce2-9184863.pdf?src-supplier=Avnet; ComponentLink2URL: https://datasheet.ciiva.com/24161/aoa0000ce2-24161481.pdf?src-supplier=Mouser; ComponentLink2Description: https://datasheet.ciiva.com/24161/aoa0000ce2-24161481.pdf?src-supplier=Mouser; ComponentLink3URL: https://datasheet.ciiva.com/7853/aoa0000ce2-7853727.pdf?src-supplier=Element14; ComponentLink3Description: https://datasheet.ciiva.com/7853/aoa0000ce2-7853727.pdf?src-supplier=Element14; ComponentLink4URL: https://datasheet.ciiva.com/22673/1678782-22673566.pdf?src-supplier=Element14; ComponentLink4Description: https://datasheet.ciiva.com/22673/1678782-22673566.pdf?src-supplier=Element14; ComponentLink5URL: https://datasheet.ciiva.com/16770/70260748-16770311.pdf?src-supplier=Allied+Electronics; ComponentLink5Description: https://datasheet.ciiva.com/16770/70260748-16770311.pdf?src-supplier=Allied+Electronics
R13 = Resistor: 贴片电阻 84500Ω ± 1.00% 0.125W ± 100ppm/℃ 0805; Manufacturer: Yageo; Manufacturer Part Number: RC0805FR-0784K5L; Tolerance: 1%; Power Rating: 125mW; Voltage Rating: 150V; Temperature Coefficient: 100ppm/°C; Link: https://www.digikey.com/es/products/detail/RC0805FR-0784K5L/311-84.5KCRCT-ND/731120?utm_campaign=buynow&utm_medium=aggregator&curr=usd&utm_source=octopart; Supplier 1: Arrow Electronics; Supplier Part Number 1: RC0805FR-0784K5L; RoHS: Yes; Category: Chip SMD Resistors; Stock 1: 148; Pricing 1: 1=0,06850, 10=0,03250, 25=0,03230, 100=0,00970 (USD); Case/Package: 0805; Case Code (Imperial): 0805; Case Code (Metric): 2012; Contact Plating: Tin,Matte,Lead; Size Code: 0805; Min Operating Temperature: -55°C; Max Operating Temperature: 155°C; Resistance: 84.5kR; Packaging: Tape and Reel; Series: RC; Max Power Dissipation: 125mW; Number of Terminations: 2; Resistor Type: Thick Film; Termination: SMD/SMT; Voltage Rating (DC): 150V; Features: Moisture Resistant; Construction: Rectangular; Length: 2mm; Width: 1.25mm; Height: 0.5mm; Depth: 1.25mm; Radiation Hardening: No; RoHS Compliant: Yes; Military Standard: Not; Lead Free: Lead Free; ComponentLink1URL: http://www.mouser.com/ds/2/447/Yageo_08112016_RC0805-968729.pdf?src-supplier=Mouser; ComponentLink1Description: http://www.mouser.com/ds/2/447/Yageo_08112016_RC0805-968729.pdf?src-supplier=Mouser; ComponentLink2URL: http://www.yageo.com/documents/recent/PYu-RC_Group_51_RoHS_L_9.pdf?src-supplier=Digi-Key; ComponentLink2Description: http://www.yageo.com/documents/recent/PYu-RC_Group_51_RoHS_L_9.pdf?src-supplier=Digi-Key; ComponentLink3URL: http://www.yageo.com/documents/recent/PYu-RC_Group_51_RoHS_L_10.pdf?src-supplier=Digi-Key; ComponentLink3Description: http://www.yageo.com/documents/recent/PYu-RC_Group_51_RoHS_L_10.pdf?src-supplier=Digi-Key; ComponentLink4URL: https://www.yageo.com/upload/media/product/productsearch/datasheet/rchip/PYu-RC_Group_51_RoHS_L_11.pdf?src-supplier=Digi-Key; ComponentLink4Description: https://www.yageo.com/upload/media/product/productsearch/datasheet/rchip/PYu-RC_Group_51_RoHS_L_11.pdf?src-supplier=Digi-Key; ComponentLink5URL: http://www.yageo.com/pdf/PYu-RC0805_51_RoHS_L_4.pdf?src-supplier=Avnet; ComponentLink5Description: http://www.yageo.com/pdf/PYu-RC0805_51_RoHS_L_4.pdf?src-supplier=Avnet; ComponentLink6URL: http://www.yageo.ru/pdf/RC0805.pdf?src-supplier=Future+Electronics; ComponentLink6Description: http://www.yageo.ru/pdf/RC0805.pdf?src-supplier=Future+Electronics
R14 = Resistor: 贴片电阻 330KΩ ±1% 1/8W ±100ppm/℃ 0805; Manufacturer: Panasonic; Manufacturer Part Number: ERJ6ENF3303V; Temperature Coefficient: 100ppm/°C; Max Power Dissipation: 125mW; Voltage Rating: 150V; Link: https://www.digikey.com/es/products/detail/ERJ-6ENF3303V/P330KCCT-ND/1746854?utm_campaign=buynow&utm_medium=aggregator&curr=usd&utm_source=octopart; Supplier 1: Newark; Supplier Part Number 1: 64R5402; RoHS: Yes; Category: Chip SMD Resistors; Stock 1: 2169; Pricing 1: 1=0,11200, 25=0,09100, 50=0,06400, 100=0,03600, 250=0,02800, 500=0,02200, 1000=0,01400 (USD); Mount: Surface Mount; Case/Package: 0805; Number of Pins: 2; Case Code (Metric): 2012; Case Code (Imperial): 0805; Contact Plating: Tin; Min Operating Temperature: -55°C; Max Operating Temperature: 155°C; Resistance: 330kR; Tolerance: 1%; Packaging: Tape and Reel; Resistor Type: Thick Film; Number of Terminations: 2; Series: ERJ; Construction: Rectangular; Power Rating: 125mW; Package Quantity: 1; Features: Automotive AEC-Q200; Termination: SMD/SMT; Resistance Tolerance: 1%; Technology: THICK FILM; Length: 2mm; Width: 0.049inch; Height: 0.6mm; Depth: 1.25mm; Radiation Hardening: No; Military Standard: Not; RoHS Compliant: Yes; REACH SVHC: No SVHC; ComponentLink1URL: https://datasheet.ciiva.com/11821/0900766b80f80784-11821637.pdf?src-supplier=RSComponents; ComponentLink1Description: https://datasheet.ciiva.com/11821/0900766b80f80784-11821637.pdf?src-supplier=RSComponents; ComponentLink2URL: https://datasheet.ciiva.com/24026/aoa0000ce2-24026247.pdf?src-supplier=Mouser; ComponentLink2Description: https://datasheet.ciiva.com/24026/aoa0000ce2-24026247.pdf?src-supplier=Mouser; ComponentLink3URL: https://datasheet.ciiva.com/16765/70260748-16765294.pdf?src-supplier=Allied+Electronics; ComponentLink3Description: https://datasheet.ciiva.com/16765/70260748-16765294.pdf?src-supplier=Allied+Electronics; ComponentLink4URL: https://datasheet.ciiva.com/9183/aoa0000ce2-9183029.pdf?src-supplier=Avnet; ComponentLink4Description: https://datasheet.ciiva.com/9183/aoa0000ce2-9183029.pdf?src-supplier=Avnet; ComponentLink5URL: https://datasheet.ciiva.com/5915/426256-5915341.pdf?src-supplier=Farnell; ComponentLink5Description: https://datasheet.ciiva.com/5915/426256-5915341.pdf?src-supplier=Farnell; ComponentLink6URL: https://datasheet.ciiva.com/7836/426256-7836539.pdf?src-supplier=Element14; ComponentLink6Description: https://datasheet.ciiva.com/7836/426256-7836539.pdf?src-supplier=Element14; ComponentLink7URL: https://datasheet.ciiva.com/7836/426256-7836824.pdf?src-supplier=Element14; ComponentLink7Description: https://datasheet.ciiva.com/7836/426256-7836824.pdf?src-supplier=Element14; ComponentLink8URL: https://datasheet.ciiva.com/22673/1678782-22673294.pdf?src-supplier=Element14; ComponentLink8Description: https://datasheet.ciiva.com/22673/1678782-22673294.pdf?src-supplier=Element14; ComponentLink9URL: https://datasheet.ciiva.com/22687/1678782-22687438.pdf?src-supplier=Element14; ComponentLink9Description: https://datasheet.ciiva.com/22687/1678782-22687438.pdf?src-supplier=Element14; ComponentLink10URL: https://datasheet.ciiva.com/46420/1678782-46420183.pdf?src-supplier=Element14; ComponentLink10Description: https://datasheet.ciiva.com/46420/1678782-46420183.pdf?src-supplier=Element14; ComponentLink11URL: https://datasheet.ciiva.com/16761/70260748-16761642.pdf?src-supplier=Allied+Electronics; ComponentLink11Description: https://datasheet.ciiva.com/16761/70260748-16761642.pdf?src-supplier=Allied+Electronics
R15 R16 = CMP-1013-00510-1: RES 1K OHM 1% 1/4W 0805; Manufacturer: Stackpole Electronics; Power Rating: 250mW; Temperature Coefficient: 100ppm/°C; Supplier 1: Digi-Key; Supplier Part Number 1: RNCP0805FTD1K00CT-ND; Manufacturer Part Number: RNCP0805FTD1K00; Stock 1: 428195; Pricing 1: 1=0,10000, 10=0,07200, 100=0,02770, 1000=0,01220, 2500=0,01053 (USD); RoHS: Yes; Mount: Surface Mount; Case/Package: 0805; Case Code (Metric): 2012; Case Code (Imperial): 0805; Min Operating Temperature: -55°C; Max Operating Temperature: 155°C; Tolerance: 1%; Packaging: Tape and Reel; Composition: Thin Film; Number of Terminations: 2; Max Power Dissipation: 250mW; Features: Moisture Resistant,Anti-Sulfur; Length: 0.079inch; Height: 0.024inch; Width: 0.049inch; Lead Free: Lead Free; ComponentLink1URL: http://www.seielect.com/Catalog/SEI-rncp.pdf?src-supplier=Future+Electronics; ComponentLink1Description: http://www.seielect.com/Catalog/SEI-rncp.pdf?src-supplier=Future+Electronics; ComponentLink2URL: https://www.seielect.com/catalog/SEI-Packaging.pdf?src-supplier=Digi-Key; ComponentLink2Description: https://www.seielect.com/catalog/SEI-Packaging.pdf?src-supplier=Digi-Key; ComponentLink3URL: https://www.seielect.com/Catalog/SEI-rncp.pdf?src-supplier=Digi-Key; ComponentLink3Description: https://www.seielect.com/Catalog/SEI-rncp.pdf?src-supplier=Digi-Key
U2 = NCV8161BSN330T1G: ON SEMICONDUCTOR - NCV8161BSN330T1G - LDO-FESTSP.REG AEC-Q100 3.3V 0.45A TSOP5; Output Type: Fixed; Output Configuration: Positive; Number of Regulators: 1; Max Input Voltage: 5.5V; Dropout Voltage: 305mV; Output Current: 450mA; Quiescent Current: 23uA; Power Supply Rejection Ratio (PSRR): 48dB; Supplier 1: RSComponents; Manufacturer: ON Semiconductor; RoHS: Yes; Category: Voltage Regulators - Linear; Stock 1: 3700; Mount: Surface Mount; Case/Package: SOT-23-5; Min Operating Temperature: -40°C; Max Operating Temperature: 125°C; Packaging: Cut Tape; Min Output Voltage: 3.3V; RoHS Compliant: Yes; ComponentLink1URL: http://www.farnell.com/datasheets/2290244.pdf?src-supplier=Farnell; ComponentLink1Description: http://www.farnell.com/datasheets/2290244.pdf?src-supplier=Farnell; ComponentLink2URL: http://www.onsemi.com/pub/Collateral/NCV8161-D.PDF?src-supplier=Digi-Key; ComponentLink2Description: http://www.onsemi.com/pub/Collateral/NCV8161-D.PDF?src-supplier=Digi-Key; ComponentLink3URL: http://www.farnell.com/datasheets/2290244.pdf?src-supplier=Newark; ComponentLink3Description: http://www.farnell.com/datasheets/2290244.pdf?src-supplier=Newark; Supplier Part Number 1: 1718403P; Pricing 1: 100=0,33700, 500=0,31900, 1000=0,24400, 3000=0,21900 (GBP); Link: https://www.digikey.com/en/products/detail/NCV8161BSN330T1G/NCV8161BSN330T1GOSCT-ND/7556483?itemSeq=375639462; Manufacturer Part Number: NCV8161BSN330T1G
U3 = LT3652HVEMSE#TRPBF: IC BATTERY CHARGER 2A 12-MSOP; Manufacturer: Analog Devices / Linear Technology; Min Supply Voltage: 4.95V; Max Supply Voltage: 34V; Number of Outputs: 1; Supplier 1: Digi-Key; Manufacturer Part Number: LT3652HVEMSE#TRPBF; Stock 1: 1907; Pricing 1: 1=8,64000, 25=6,34520, 100=4,74420, 250=4,50696, 500=4,40532 (USD); RoHS: Yes; Case/Package: SOP; Number of Pins: 12; Min Operating Temperature: -40°C; Max Operating Temperature: 125°C; Package Quantity: 2500; Output Current: 2A; Packaging: Tape and Reel; Max Input Voltage: 34V; Min Input Voltage: 4.95V; ComponentLink1URL: https://datasheet.ciiva.com/26874/lt3652hvemse-trpbf-26874414.pdf?src-supplier=IIIC; ComponentLink1Description: https://datasheet.ciiva.com/26874/lt3652hvemse-trpbf-26874414.pdf?src-supplier=IIIC; ComponentLink2URL: https://datasheet.ciiva.com/1934/3652hvfa-1934001.pdf?src-supplier=Digi-Key; ComponentLink2Description: https://datasheet.ciiva.com/1934/3652hvfa-1934001.pdf?src-supplier=Digi-Key; Supplier Part Number 1: LT3652HVEMSE#TRPBFCT-ND; Link: https://www.digikey.com/en/products/detail/analog-devices-inc/LT3652HVEMSE-TRPBF/2334067?s=N4IgTCBcDaIDIBUDMA2ArGAEgNQKIFkBlXAYgQCUAFAIQDEQBdAXyA